# EAGLE design cft-int-board (EAGLE 5.11)
DRAWN_BY: Alexios; PROJECT_NAME: CFT Mini-Computer; REVISION: Rev J; SHEET_DESCRIPTION: Bus Connectors; SIMULATION_FILENAME: N/A; URL: http://www.bedroomlan.org/cft

## Sheet 1 of 3
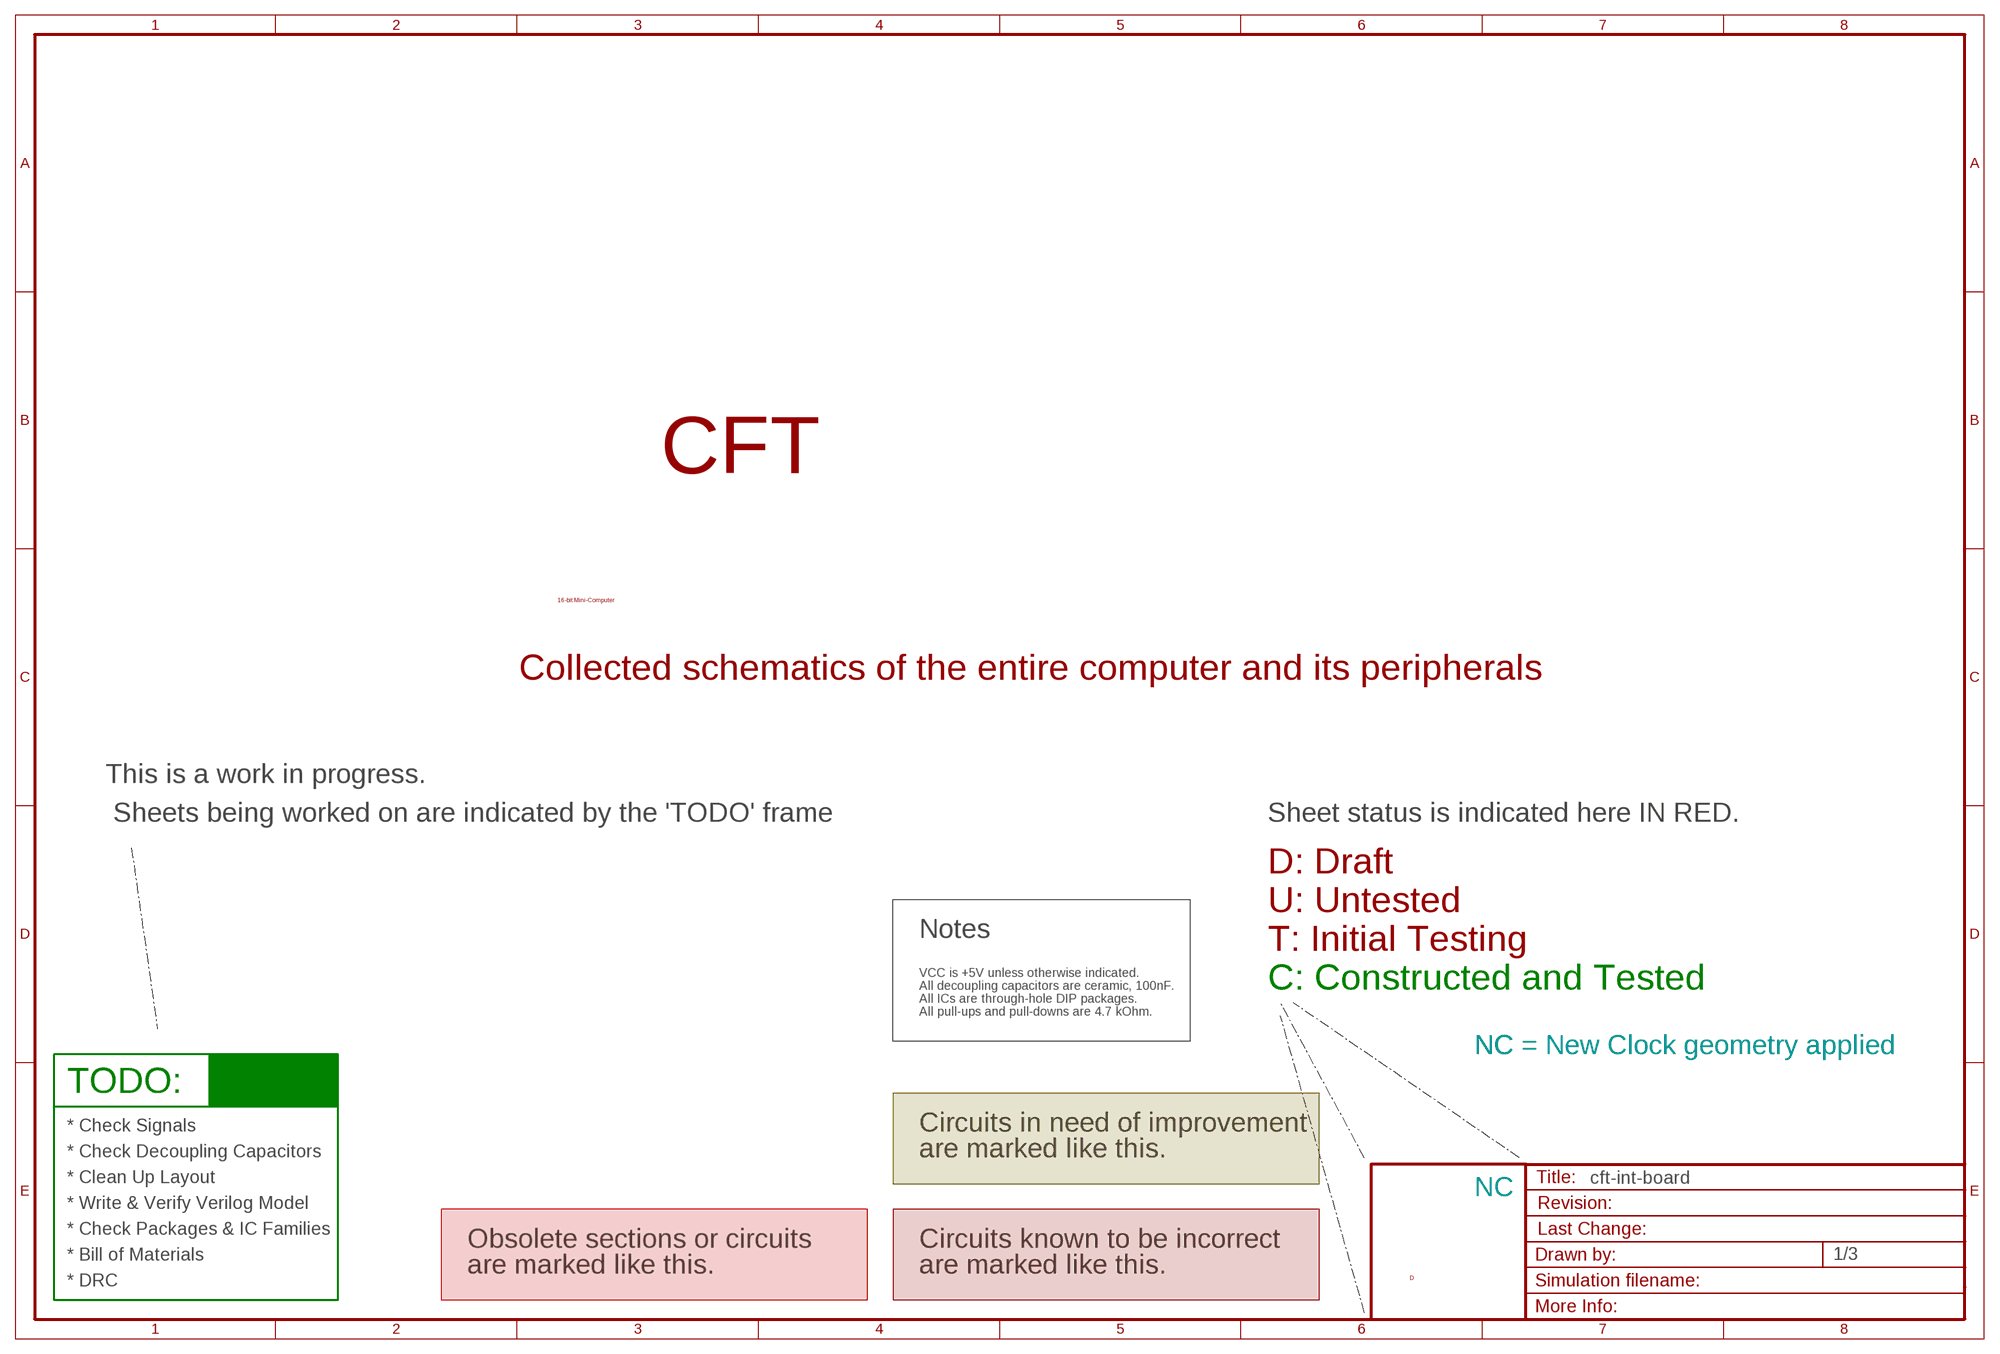
[diagram p0: schematic, sheet 1]

### Notes on the sheet
- CFT
- 16-bit Mini-Computer
- Collected schematics of the entire computer and its peripherals
- This is a work in progress.
- Sheets being worked on are indicated by the 'TODO' frame | Sheet status is indicated here IN RED.
- D: Draft
- U: Untested
- Notes
- T: Initial Testing
- VCC is +5V unless otherwise indicated.
- All decoupling capacitors are ceramic, 100nF. | C: Constructed and Tested
- All ICs are through-hole DIP packages.
- All pull-ups and pull-downs are 4.7 kOhm.
- NC | NC = New Clock geometry applied
- TODO:
- * Check Signals | Circuits in need of improvement
- * Check Decoupling Capacitors | are marked like this.
- * Clean Up Layout
- NC
- * Write & Verify Verilog Model
- * Check Packages & IC Families
- Obsolete sections or circuits | Circuits known to be incorrect
- * Bill of Materials
- are marked like this. | are marked like this.
- D
- * DRC

## Sheet 2 of 3
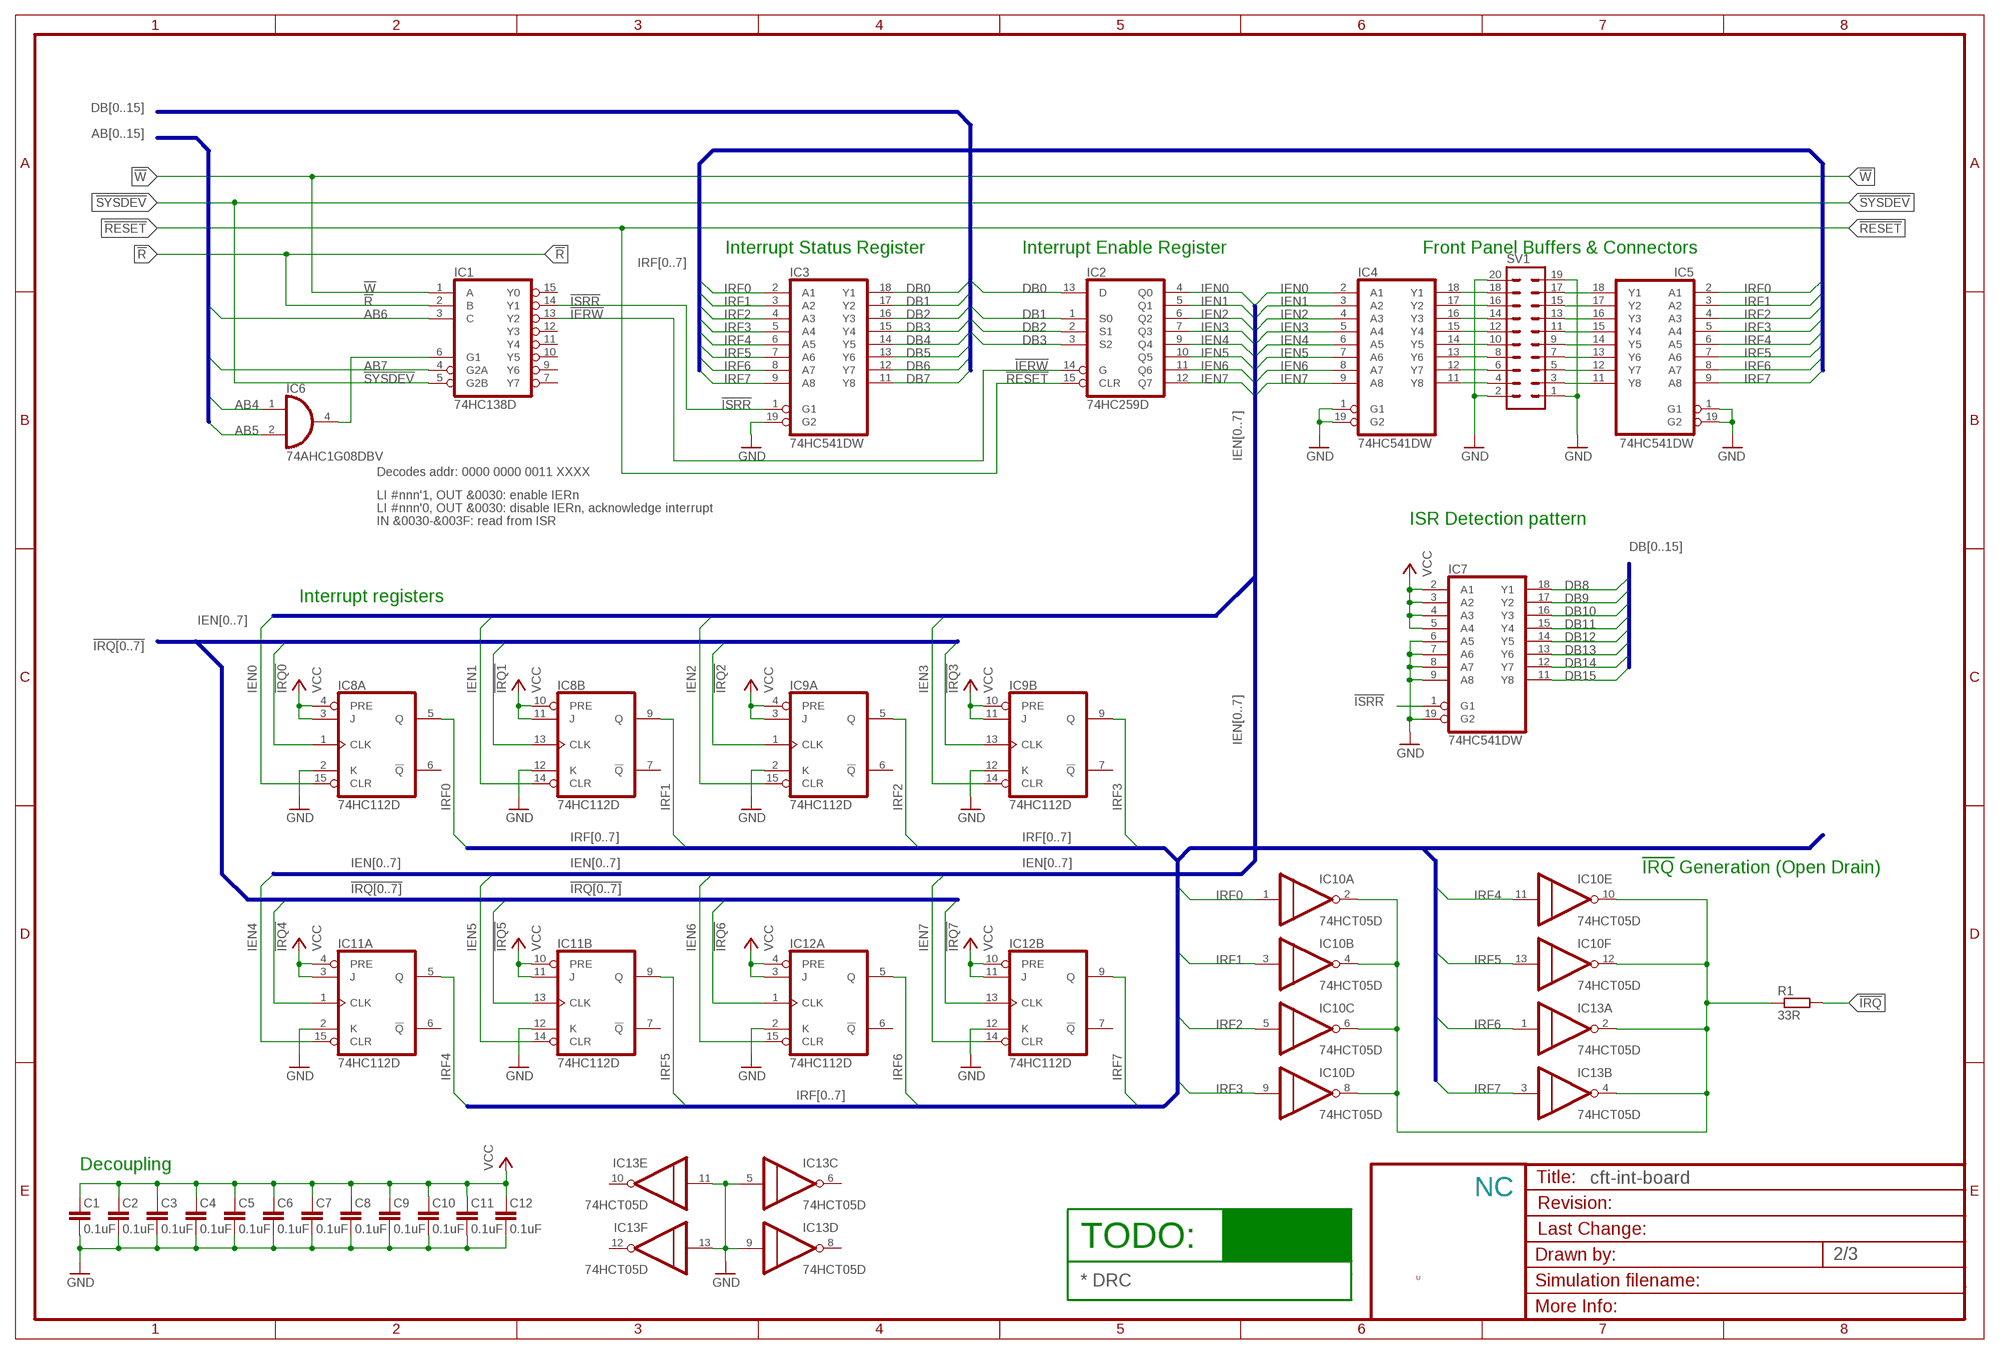
[diagram p1: schematic, sheet 2]

### Parts
C1  0.1uF  C-EUC0805K  [C0805K]
C2  0.1uF  C-EUC0805K  [C0805K]
C3  0.1uF  C-EUC0805K  [C0805K]
C4  0.1uF  C-EUC0805K  [C0805K]
C5  0.1uF  C-EUC0805K  [C0805K]
C6  0.1uF  C-EUC0805K  [C0805K]
C7  0.1uF  C-EUC0805K  [C0805K]
C8  0.1uF  C-EUC0805K  [C0805K]
C9  0.1uF  C-EUC0805K  [C0805K]
C10  0.1uF  C-EUC0805K  [C0805K]
C11  0.1uF  C-EUC0805K  [C0805K]
C12  0.1uF  C-EUC0805K  [C0805K]
IC1  74HC138D  [SO16]
IC2  74HC259D  [SO16]
IC3  74HC541DW  [SO20W]
IC4  74HC541DW  [SO20W]
IC5  74HC541DW  [SO20W]
IC6  74AHC1G08DBV  [SOT23-5]
IC7  74HC541DW  [SO20W]
IC8  74HC112D  [SO16]
IC9  74HC112D  [SO16]
IC10  74HCT05D  [SO14]
IC11  74HC112D  [SO16]
IC12  74HC112D  [SO16]
IC13  74HCT05D  [SO14]
R1  33R  R-EU_M0805  [M0805]
SV1  ML20L  [ML20L]

### Nets
!IERW: IC1.13(Y2) IC2.14(G)
!IRQ: R1.2 ; also sheet 3
!IRQ0: IC8.1(A:CLK) ; also sheet 3
!IRQ1: IC8.13(B:CLK) ; also sheet 3
!IRQ2: IC9.1(A:CLK) ; also sheet 3
!IRQ3: IC9.13(B:CLK) ; also sheet 3
!IRQ4: IC11.1(A:CLK) ; also sheet 3
!IRQ5: IC11.13(B:CLK) ; also sheet 3
!IRQ6: IC12.1(A:CLK) ; also sheet 3
!IRQ7: IC12.13(B:CLK) ; also sheet 3
!IRQ-OUT: IC10.2(A:O) IC10.4(B:O) IC10.6(C:O) IC10.8(D:O) IC10.10(E:O) IC10.12(F:O) IC13.2(A:O) IC13.4(B:O) R1.1
!ISRR: IC1.14(Y1) IC3.1(G1) IC7.1(G1)
!R: IC1.2(B) ; also sheet 3
!RESET: IC2.15(CLR) ; also sheet 3
!SYSDEV: IC1.5(G2B) ; also sheet 3
!W: IC1.1(A) ; also sheet 3
AB4: IC6.1(I0) ; also sheet 3
AB5: IC6.2(I1) ; also sheet 3
AB6: IC1.3(C) ; also sheet 3
AB7: IC1.4(G2A) ; also sheet 3
DB0: IC2.13(D) IC3.18(Y1) ; also sheet 3
DB1: IC2.1(S0) IC3.17(Y2) ; also sheet 3
DB2: IC2.2(S1) IC3.16(Y3) ; also sheet 3
DB3: IC2.3(S2) IC3.15(Y4) ; also sheet 3
DB4: IC3.14(Y5) ; also sheet 3
DB5: IC3.13(Y6) ; also sheet 3
DB6: IC3.12(Y7) ; also sheet 3
DB7: IC3.11(Y8) ; also sheet 3
DB8: IC7.18(Y1) ; also sheet 3
DB9: IC7.17(Y2) ; also sheet 3
DB10: IC7.16(Y3) ; also sheet 3
DB11: IC7.15(Y4) ; also sheet 3
DB12: IC7.14(Y5) ; also sheet 3
DB13: IC7.13(Y6) ; also sheet 3
DB14: IC7.12(Y7) ; also sheet 3
DB15: IC7.11(Y8) ; also sheet 3
GND [low power]: C1.1 C2.1 IC3.19(G2) IC4.1(G1) IC4.19(G2) IC5.1(G1) IC5.19(G2) IC7.6(A5) IC7.7(A6) IC7.8(A7) IC7.9(A8) IC7.19(G2) IC8.2(A:K) IC8.12(B:K) IC9.2(A:K) IC9.12(B:K) IC11.2(A:K) IC11.12(B:K) IC12.2(A:K) IC12.12(B:K) IC13.5(C:I) IC13.9(D:I) IC13.11(E:I) IC13.13(F:I) SV1.1 SV1.2 SV1.19 SV1.20 ; also sheet 3
IEN0: IC2.4(Q0) IC4.2(A1) IC8.15(A:CLR)
IEN1: IC2.5(Q1) IC4.3(A2) IC8.14(B:CLR)
IEN2: IC2.6(Q2) IC4.4(A3) IC9.15(A:CLR)
IEN3: IC2.7(Q3) IC4.5(A4) IC9.14(B:CLR)
IEN4: IC2.9(Q4) IC4.6(A5) IC11.15(A:CLR)
IEN5: IC2.10(Q5) IC4.7(A6) IC11.14(B:CLR)
IEN6: IC2.11(Q6) IC4.8(A7) IC12.15(A:CLR)
IEN7: IC2.12(Q7) IC4.9(A8) IC12.14(B:CLR)
IRF0: IC3.2(A1) IC5.2(A1) IC8.5(A:Q) IC10.1(A:I)
IRF1: IC3.3(A2) IC5.3(A2) IC8.9(B:Q) IC10.3(B:I)
IRF2: IC3.4(A3) IC5.4(A3) IC9.5(A:Q) IC10.5(C:I)
IRF3: IC3.5(A4) IC5.5(A4) IC9.9(B:Q) IC10.9(D:I)
IRF4: IC3.6(A5) IC5.6(A5) IC10.11(E:I) IC11.5(A:Q)
IRF5: IC3.7(A6) IC5.7(A6) IC10.13(F:I) IC11.9(B:Q)
IRF6: IC3.8(A7) IC5.8(A7) IC12.5(A:Q) IC13.1(A:I)
IRF7: IC3.9(A8) IC5.9(A8) IC12.9(B:Q) IC13.3(B:I)
N$1: IC4.18(Y1) SV1.18
N$2: IC4.17(Y2) SV1.16
N$3: IC4.16(Y3) SV1.14
N$4: IC4.15(Y4) SV1.12
N$5: IC4.14(Y5) SV1.10
N$6: IC4.13(Y6) SV1.8
N$7: IC4.12(Y7) SV1.6
N$8: IC4.11(Y8) SV1.4
N$9: IC5.18(Y1) SV1.17
N$10: IC5.17(Y2) SV1.15
N$11: IC5.16(Y3) SV1.13
N$12: IC5.15(Y4) SV1.11
N$13: IC5.14(Y5) SV1.9
N$14: IC5.13(Y6) SV1.7
N$15: IC5.12(Y7) SV1.5
N$16: IC5.11(Y8) SV1.3
N$381: IC1.6(G1) IC6.4(O)
VCC [low power]: C1.2 C2.2 IC7.2(A1) IC7.3(A2) IC7.4(A3) IC7.5(A4) IC8.3(A:J) IC8.4(A:PRE) IC8.10(B:PRE) IC8.11(B:J) IC9.3(A:J) IC9.4(A:PRE) IC9.10(B:PRE) IC9.11(B:J) IC11.3(A:J) IC11.4(A:PRE) IC11.10(B:PRE) IC11.11(B:J) IC12.3(A:J) IC12.4(A:PRE) IC12.10(B:PRE) IC12.11(B:J) ; also sheet 3
Unconnected: C3.1 C3.2 C4.1 C4.2 C5.1 C5.2 C6.1 C6.2 C7.1 C7.2 C8.1 C8.2 C9.1 C9.2 C10.1 C10.2 C11.1 C11.2 C12.1 C12.2 IC1.7(Y7) IC1.9(Y6) IC1.10(Y5) IC1.11(Y4) IC1.12(Y3) IC1.15(Y0) IC8.6(A:!Q) IC8.7(B:!Q) IC9.6(A:!Q) IC9.7(B:!Q) IC11.6(A:!Q) IC11.7(B:!Q) IC12.6(A:!Q) IC12.7(B:!Q) IC13.6(C:O) IC13.8(D:O) IC13.10(E:O) IC13.12(F:O)

### Buses
AB[0..15]
DB[0..15]
!IRQ[0..7]
IEN[0..7]
IRF[0..7]

### Notes on the sheet
- Interrupt Status Register | Interrupt Enable Register | Front Panel Buffers & Connectors
- Decodes addr: 0000 0000 0011 XXXX
- LI #nnn'1, OUT &0030: enable IERn
- LI #nnn'0, OUT &0030: disable IERn, acknowledge interrupt
- IN &0030-&003F: read from ISR | ISR Detection pattern
- Interrupt registers
- !IRQ! Generation (Open Drain)
- Decoupling
- NC
- TODO:
- U
- * DRC

## Sheet 3 of 3
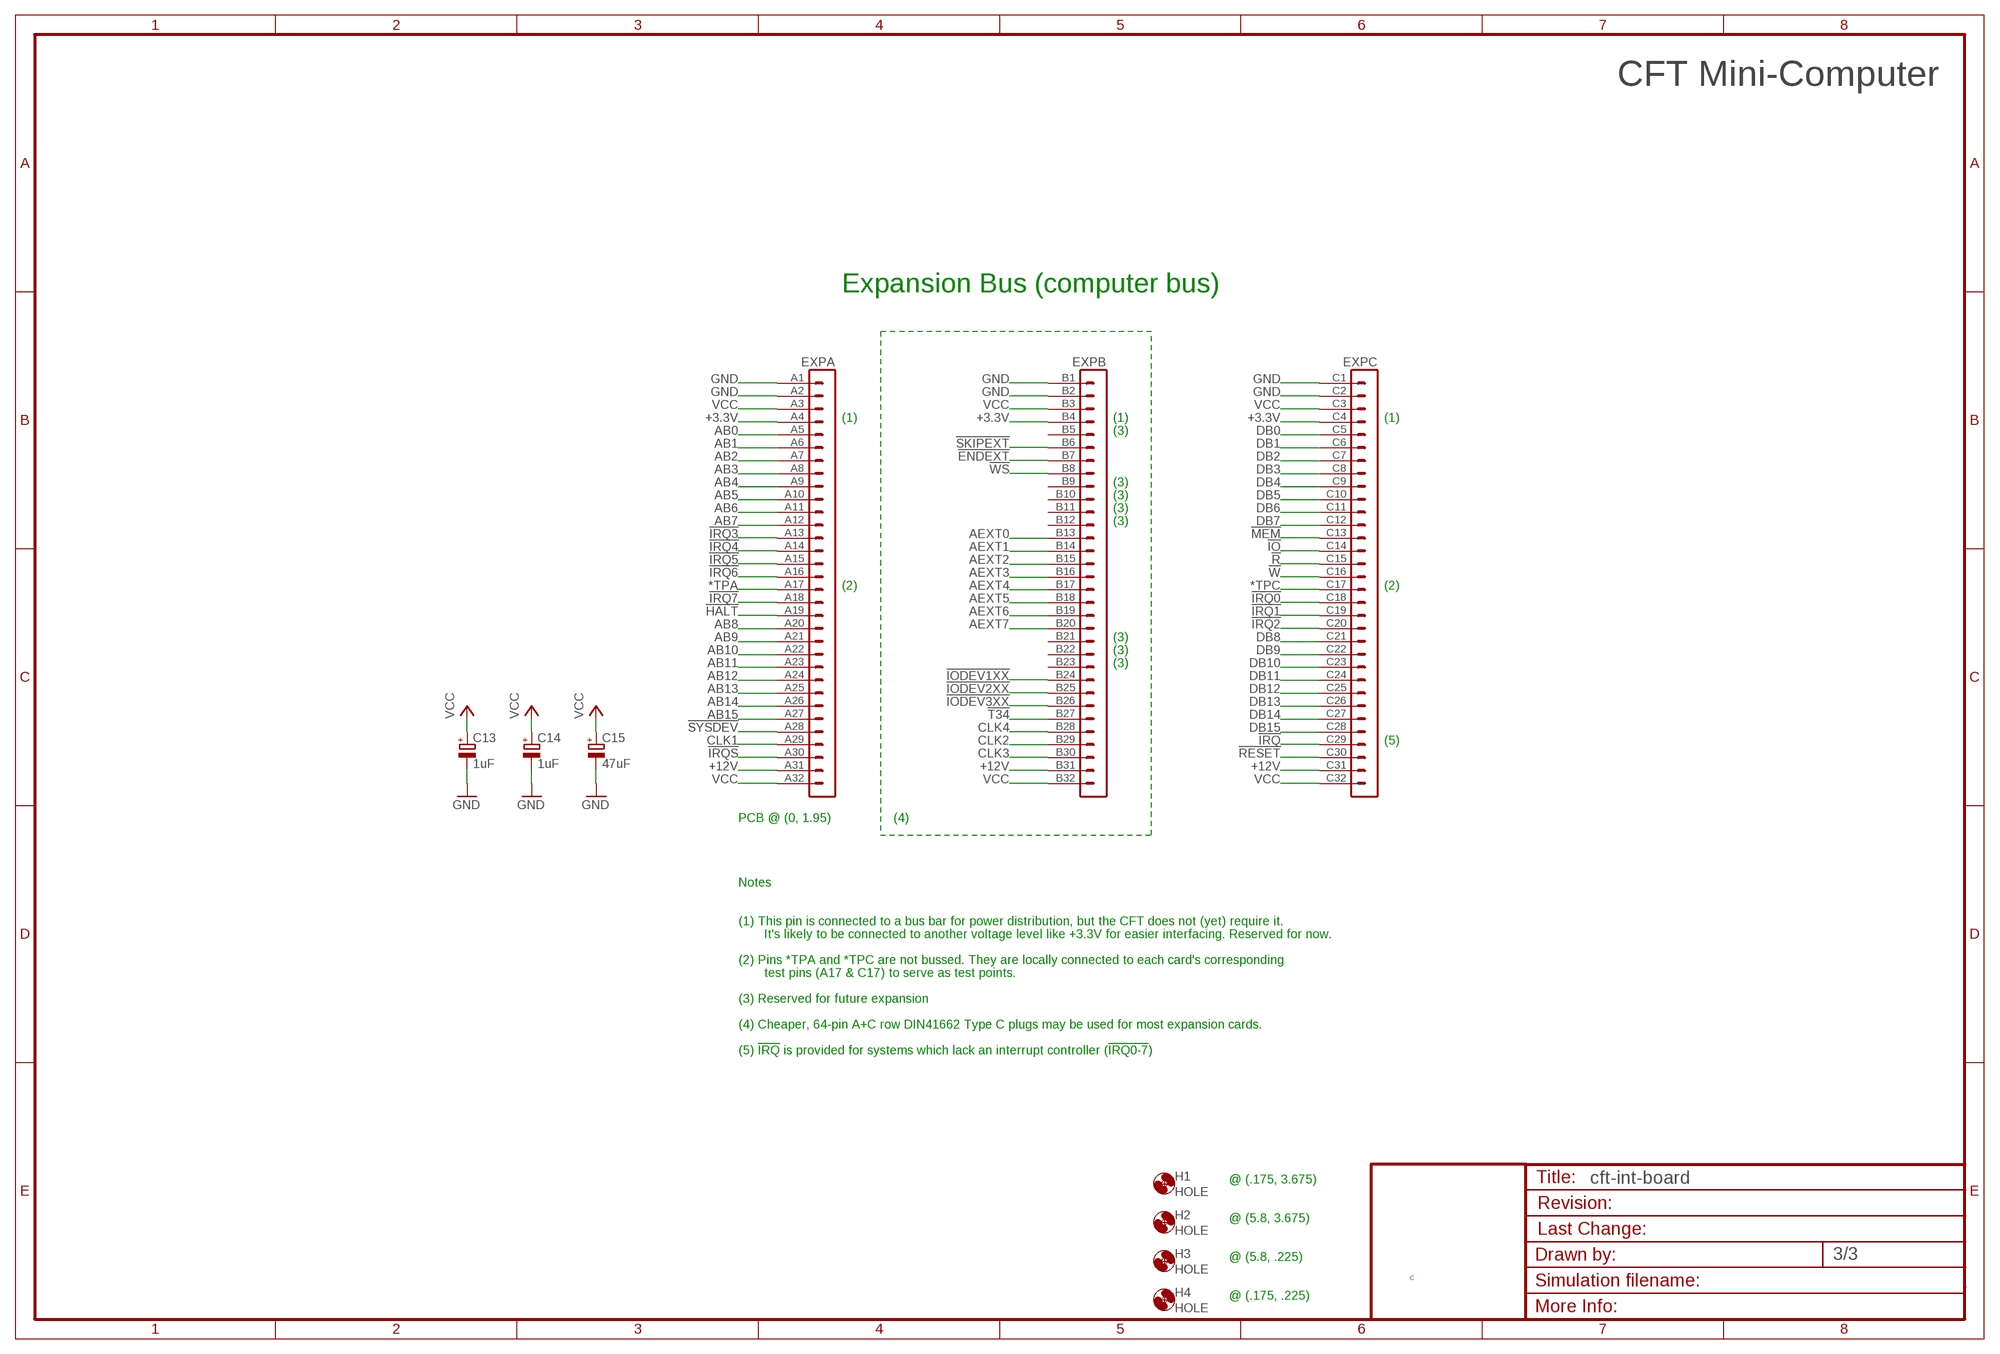
[diagram p2: schematic, sheet 3]

### Parts
C13  1uF  CPOL-EUE2.5-5  [E2,5-5]
C14  1uF  CPOL-EUE2.5-5  [E2,5-5]
C15  47uF  CPOL-EUE2.5-5  [E2,5-5]
EXP  VG96-3K  [VG96K]
H1  HOLE  [STANDOFF_28_60]
H2  HOLE  [STANDOFF_28_60]
H3  HOLE  [STANDOFF_28_60]
H4  HOLE  [STANDOFF_28_60]

### Nets
!ENDEXT: EXP.B7
!HALT: EXP.A19
!IO: EXP.C14
!IODEV1XX: EXP.B24
!IODEV2XX: EXP.B25
!IODEV3XX: EXP.B26
!IRQ: EXP.C29 ; also sheet 2
!IRQ0: EXP.C18 ; also sheet 2
!IRQ1: EXP.C19 ; also sheet 2
!IRQ2: EXP.C20 ; also sheet 2
!IRQ3: EXP.A13 ; also sheet 2
!IRQ4: EXP.A14 ; also sheet 2
!IRQ5: EXP.A15 ; also sheet 2
!IRQ6: EXP.A16 ; also sheet 2
!IRQ7: EXP.A18 ; also sheet 2
!IRQS: EXP.A30
!MEM: EXP.C13
!R: EXP.C15 ; also sheet 2
!RESET: EXP.C30 ; also sheet 2
!SKIPEXT: EXP.B6
!SYSDEV: EXP.A28 ; also sheet 2
!T34: EXP.B27
!W: EXP.C16 ; also sheet 2
!WS: EXP.B8
*TPA: EXP.A17
*TPC: EXP.C17
+3.3V: EXP.A4 EXP.B4 EXP.C4
+12V [LED power]: EXP.A31 EXP.B31 EXP.C31
AB0: EXP.A5
AB1: EXP.A6
AB2: EXP.A7
AB3: EXP.A8
AB4: EXP.A9 ; also sheet 2
AB5: EXP.A10 ; also sheet 2
AB6: EXP.A11 ; also sheet 2
AB7: EXP.A12 ; also sheet 2
AB8: EXP.A20
AB9: EXP.A21
AB10: EXP.A22
AB11: EXP.A23
AB12: EXP.A24
AB13: EXP.A25
AB14: EXP.A26
AB15: EXP.A27
AEXT0: EXP.B13
AEXT1: EXP.B14
AEXT2: EXP.B15
AEXT3: EXP.B16
AEXT4: EXP.B17
AEXT5: EXP.B18
AEXT6: EXP.B19
AEXT7: EXP.B20
CLK1: EXP.A29
CLK2: EXP.B29
CLK3: EXP.B30
CLK4: EXP.B28
DB0: EXP.C5 ; also sheet 2
DB1: EXP.C6 ; also sheet 2
DB2: EXP.C7 ; also sheet 2
DB3: EXP.C8 ; also sheet 2
DB4: EXP.C9 ; also sheet 2
DB5: EXP.C10 ; also sheet 2
DB6: EXP.C11 ; also sheet 2
DB7: EXP.C12 ; also sheet 2
DB8: EXP.C21 ; also sheet 2
DB9: EXP.C22 ; also sheet 2
DB10: EXP.C23 ; also sheet 2
DB11: EXP.C24 ; also sheet 2
DB12: EXP.C25 ; also sheet 2
DB13: EXP.C26 ; also sheet 2
DB14: EXP.C27 ; also sheet 2
DB15: EXP.C28 ; also sheet 2
GND [low power]: C13.- C14.- C15.- EXP.A1 EXP.A2 EXP.B1 EXP.B2 EXP.C1 EXP.C2 ; also sheet 2
VCC [low power]: C13.+ C14.+ C15.+ EXP.A3 EXP.A32 EXP.B3 EXP.B32 EXP.C3 EXP.C32 ; also sheet 2
Unconnected: EXP.B5 EXP.B9 EXP.B10 EXP.B11 EXP.B12 EXP.B21 EXP.B22 EXP.B23

### Notes on the sheet
- CFT Mini-Computer
- Expansion Bus (computer bus)
- (1) | (1) | (1)
- (3)
- (3)
- (3)
- (3)
- (3)
- (2) | (2)
- (3)
- (3)
- (3)
- (5)
- PCB @ (0, 1.95) | (4)
- Notes
- (1) This pin is connected to a bus bar for power distribution, but the CFT does not (yet) require it.
- It's likely to be connected to another voltage level like +3.3V for easier interfacing. Reserved for now.
- (2) Pins *TPA and *TPC are not bussed. They are locally connected to each card's corresponding
- test pins (A17 & C17) to serve as test points.
- (3) Reserved for future expansion
- (4) Cheaper, 64-pin A+C row DIN41662 Type C plugs may be used for most expansion cards.
- (5) !IRQ! is provided for systems which lack an interrupt controller (!IRQ0-7!)
- @ (.175, 3.675)
- @ (5.8, 3.675)
- @ (5.8, .225)
- C
- @ (.175, .225)

## Power pins joined to a net without a drawn wire
GND: IC1.8(GND) IC2.8(GND) IC3.10(GND) IC4.10(GND) IC5.10(GND) IC6.3(GND) IC7.10(GND) IC8.8(P:GND) IC9.8(P:GND) IC10.7(P:GND) IC11.8(P:GND) IC12.8(P:GND) IC13.7(P:GND)
VCC: IC1.16(VCC) IC2.16(VCC) IC3.20(VCC) IC4.20(VCC) IC5.20(VCC) IC6.5(VCC) IC7.20(VCC) IC8.16(P:VCC) IC9.16(P:VCC) IC10.14(P:VCC) IC11.16(P:VCC) IC12.16(P:VCC) IC13.14(P:VCC)

## Library data of the parts
C1-C12 = rcl:C-EU: CAPACITOR, European symbol
C13-C15 = rcl:CPOL-EU: POLARIZED CAPACITOR, European symbol
EXP = alexios-19inch:VG96-3: PCB EUROCARD, 96-pin type C/ABC, 2.54 mm
H1-H4 = alexios:HOLE: Hole for a standoff or mount. Hole diameter: 3.3mm. External Diameter: 6mm.
IC1 = alexios:74*138: 3-line to 8-line DECODER/DEMULTIPLEXER
IC2 = alexios:74*259: 8-bit addressable LATCH
IC3-IC5 IC7 = alexios:74*541: Octal BUFFER and LINE DRIVER, 3-state
IC6 = alexios:74*1G08: 2-input AND gate
IC8 IC9 IC11 IC12 = alexios:74*112: Dual J-K negative edge triggered FLIP FLOP, preset and clear
IC10 IC13 = alexios:74*05: Hex INVERTER, open collector/drain
R1 = resistor:R-EU_: RESISTOR, European symbol
SV1 = con-harting-ml:ML20: HARTING; OC_FARNELL: unknown; OC_NEWARK: unknown

## Net classes
0 default: width 0.305 mm, clearance 0.203 mm
1 low power: width 1.27 mm, clearance 0.254 mm
2 LED power: width 1.93 mm, clearance 0.254 mm

## Board
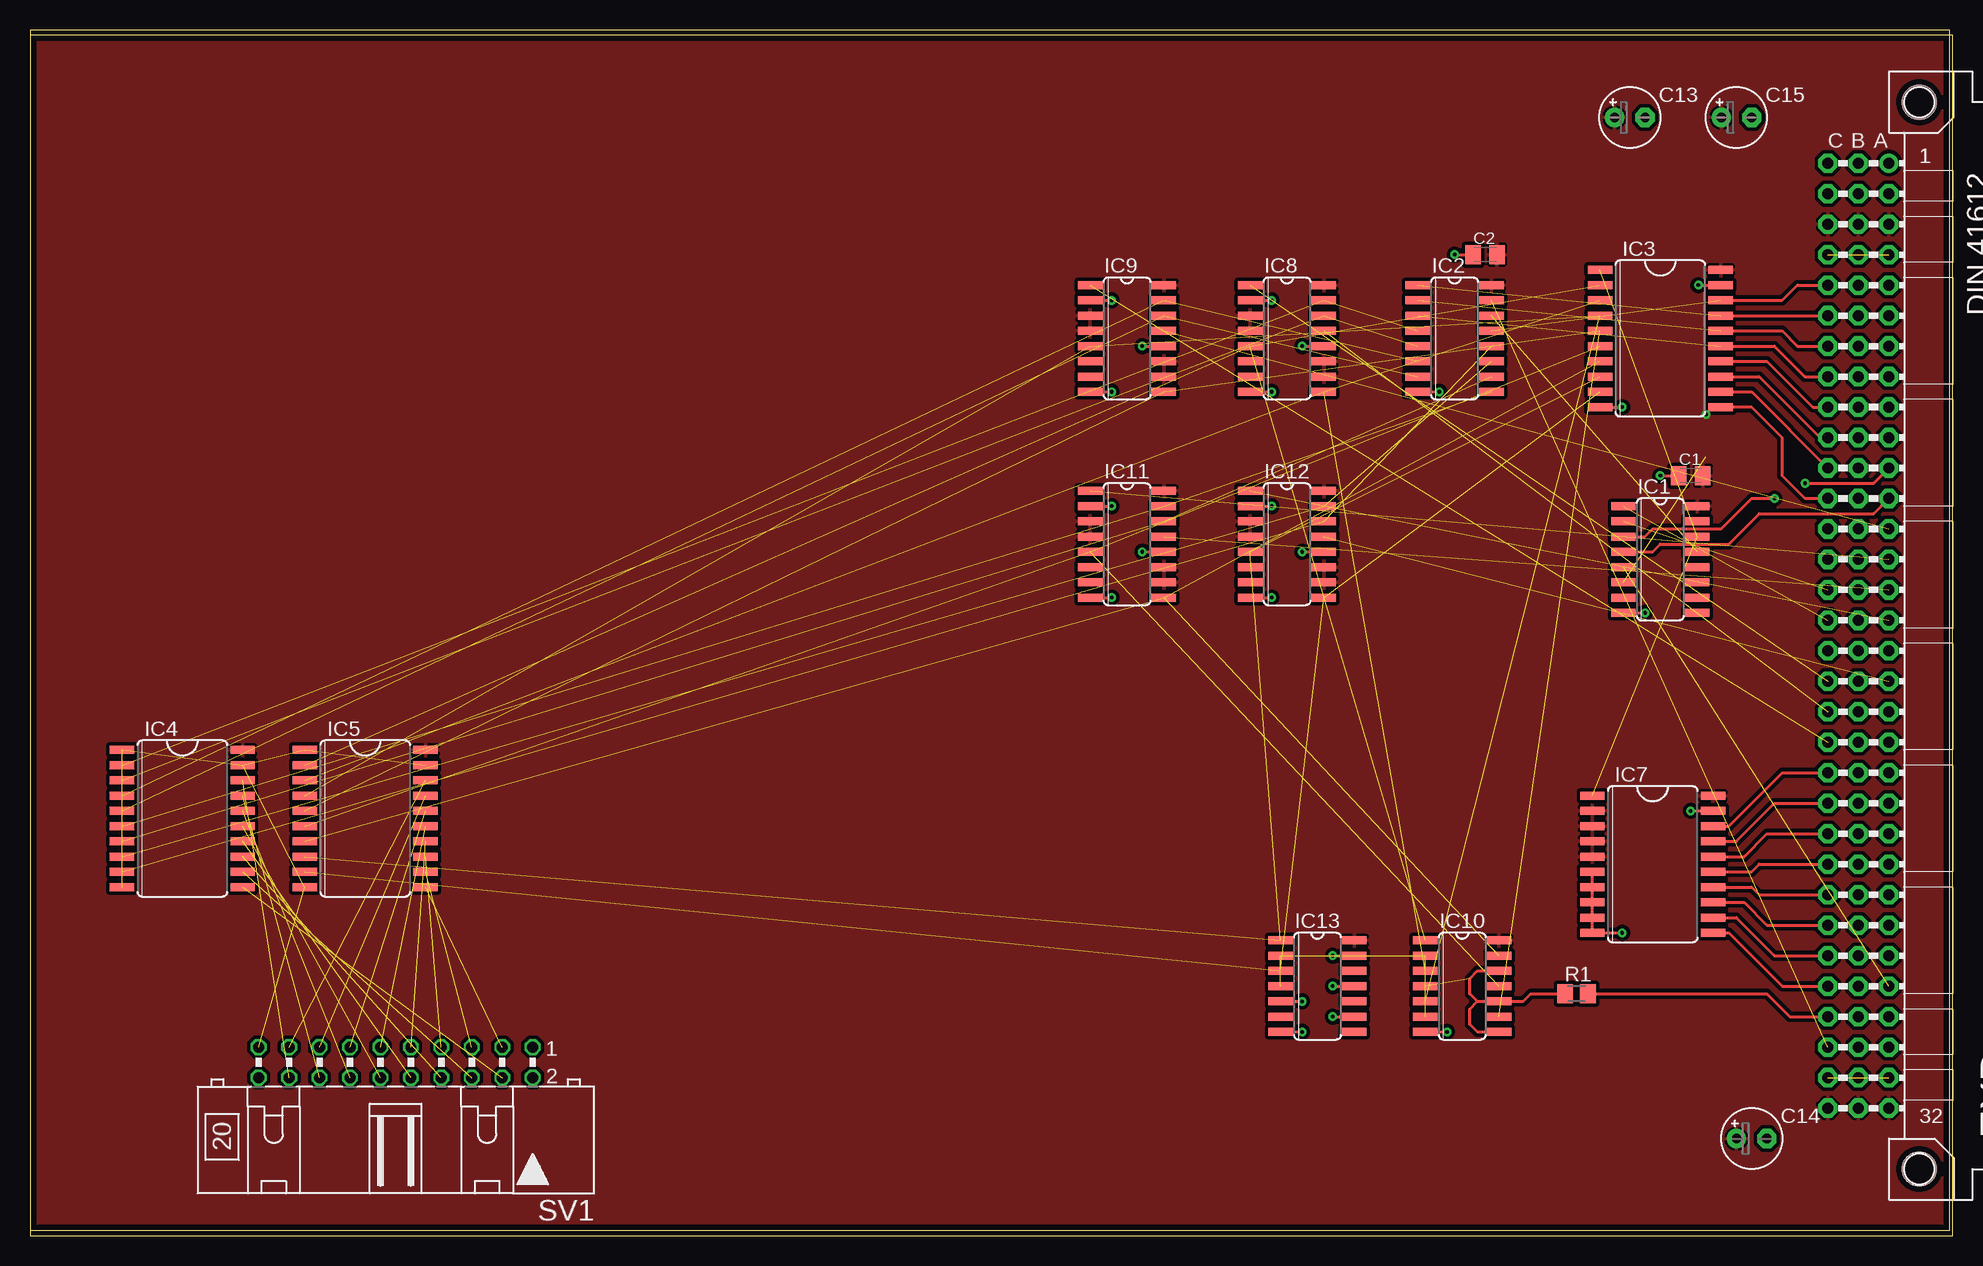
[diagram p3: board, top side]
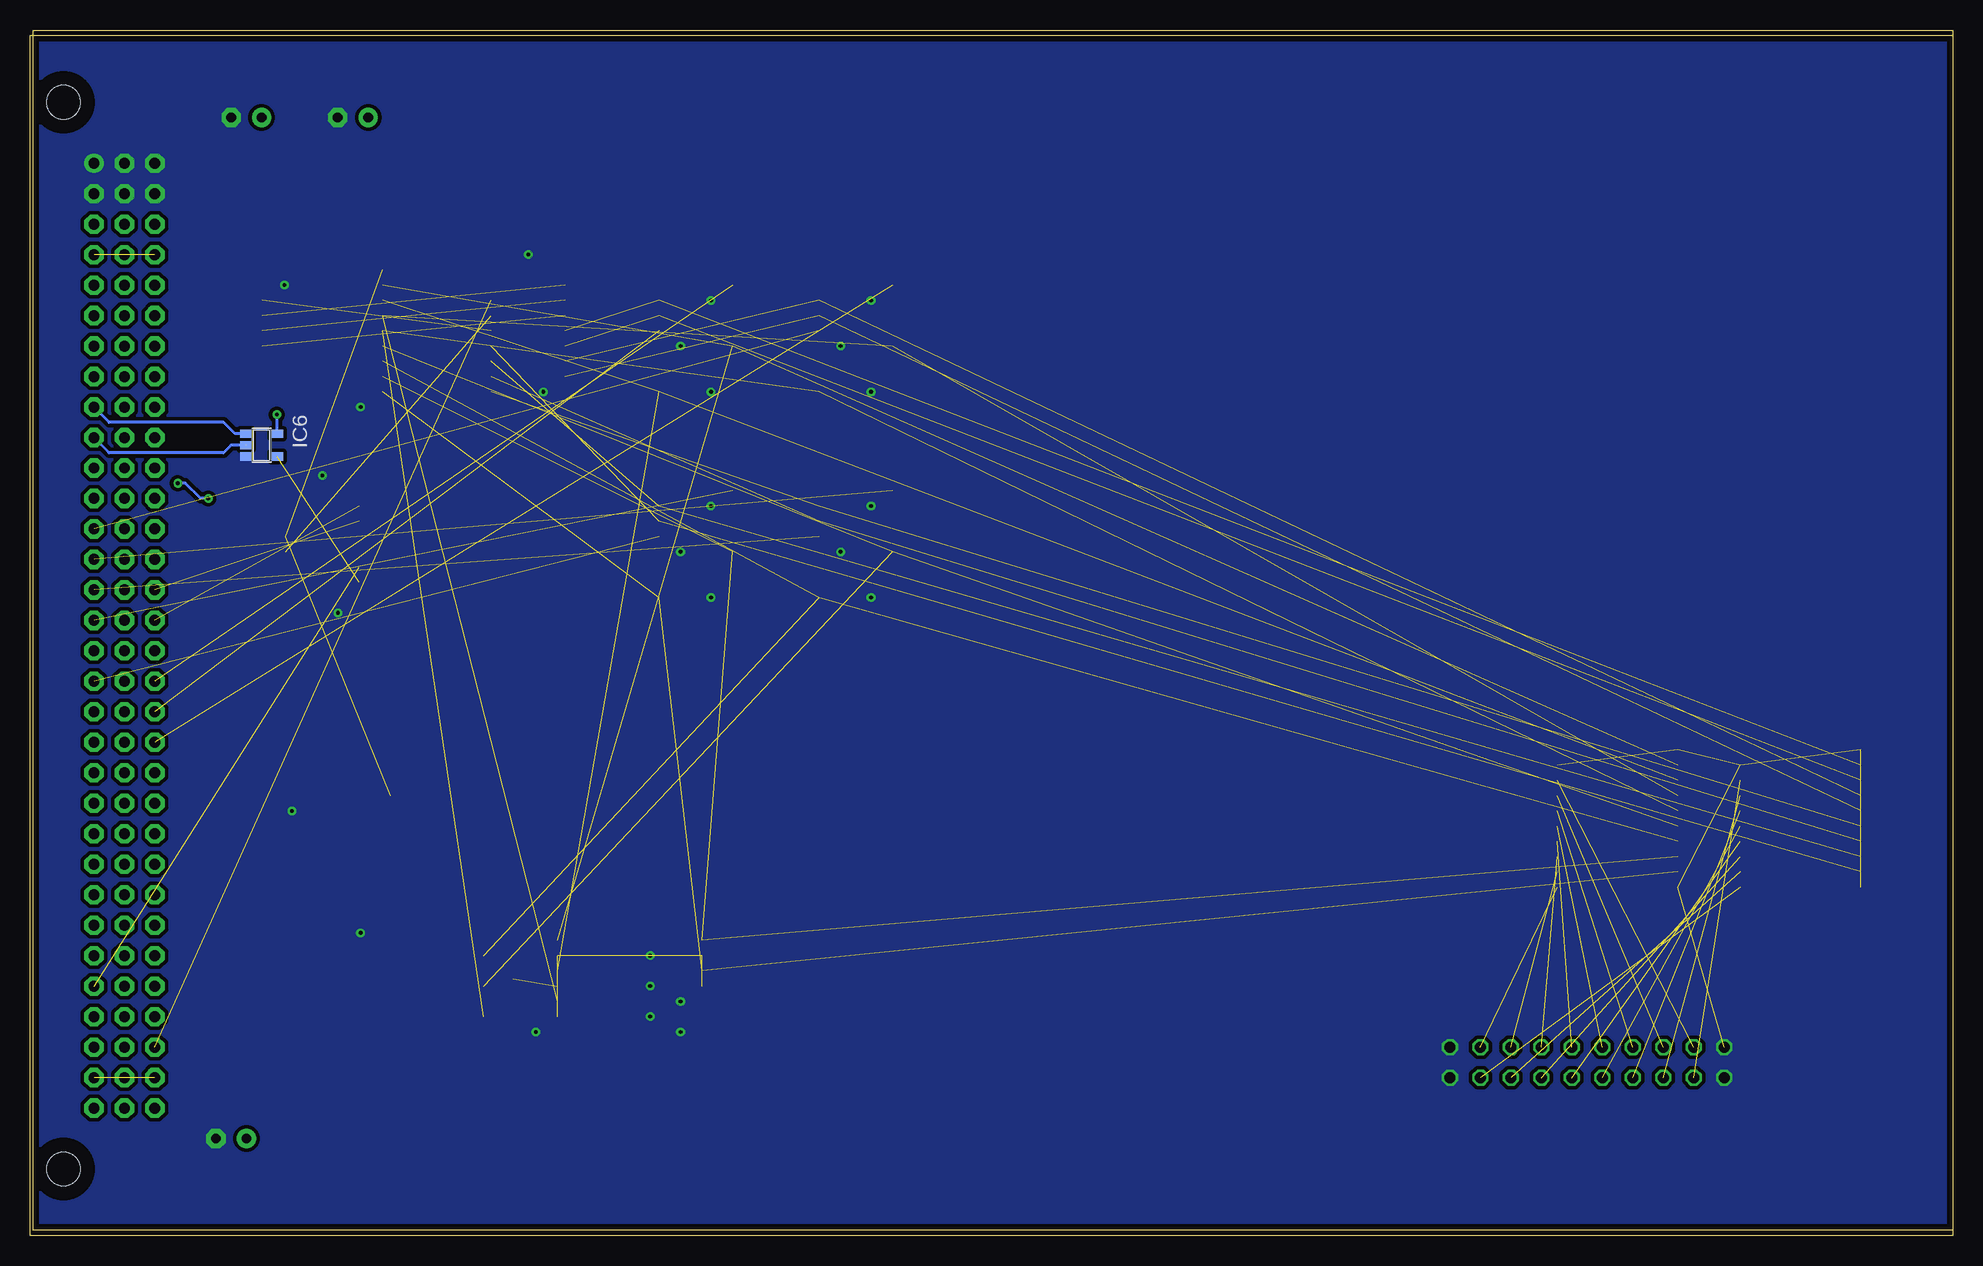
[diagram p4: board, bottom side, seen from below]

Size 160 x 100 mm. Coordinates in mm from the lower left corner, seen from the top.
Outline: 0,0 160,0 160,100 0,100 0,0
Copper layers (1*16): Top 0.035mm / dielectric 0.2mm / Bottom 0.035mm
Design rules "MyroPCB-8mil-prototyping": minimum track width 8mil, minimum drill 12mil, track to track 8mil, track to pad 8mil, pad to pad 8mil, via to via 8mil, smd to smd 8mil, copper to edge 20mil, drill to drill 8mil, minimum pad ring 8mil, minimum via ring 8mil, stop-mask expansion 4mil, vias tented up to drill 0mil, thermal gap 8mil

### Footprints (pad centres in the part's own frame; a part is rotated, then mirrored left to right if it is on the bottom)
C0805K = smd 1.3 x 1.6: 1 -1,0; 2 1,0
E2,5-5 = drill 0.813 pad 1.6 round: + -1.27,0 | drill 0.813 pad 1.6 octagon: - 1.27,0
VG96K = drill 0.914 pad 1.6 round: A1 154.94,39.37 | drill 0.914 pad 1.6 octagon: A2 154.94,36.83; A3 154.94,34.29; A4 154.94,31.75; A5 154.94,29.21; A6 154.94,26.67; A7 154.94,24.13; A8 154.94,21.59; A9 154.94,19.05; A10 154.94,16.51; A11 154.94,13.97; A12 154.94,11.43; A13 154.94,8.89; A14 154.94,6.35; A15 154.94,3.81; A16 154.94,1.27; A17 154.94,-1.27; A18 154.94,-3.81; A19 154.94,-6.35; A20 154.94,-8.89; A21 154.94,-11.43; A22 154.94,-13.97; A23 154.94,-16.51; A24 154.94,-19.05; A25 154.94,-21.59; A26 154.94,-24.13; A27 154.94,-26.67; A28 154.94,-29.21; A29 154.94,-31.75; A30 154.94,-34.29; A31 154.94,-36.83; A32 154.94,-39.37; B1 152.4,39.37; B2 152.4,36.83; B3 152.4,34.29; B4 152.4,31.75; B5 152.4,29.21; B6 152.4,26.67; B7 152.4,24.13; B8 152.4,21.59; B9 152.4,19.05; B10 152.4,16.51; B11 152.4,13.97; B12 152.4,11.43; B13 152.4,8.89; B14 152.4,6.35; B15 152.4,3.81; B16 152.4,1.27; B17 152.4,-1.27; B18 152.4,-3.81; B19 152.4,-6.35; B20 152.4,-8.89; B21 152.4,-11.43; B22 152.4,-13.97; B23 152.4,-16.51; B24 152.4,-19.05; B25 152.4,-21.59; B26 152.4,-24.13; B27 152.4,-26.67; B28 152.4,-29.21; B29 152.4,-31.75; B30 152.4,-34.29; B31 152.4,-36.83; B32 152.4,-39.37; C1 149.86,39.37; C2 149.86,36.83; C3 149.86,34.29; C4 149.86,31.75; C5 149.86,29.21; C6 149.86,26.67; C7 149.86,24.13; C8 149.86,21.59; C9 149.86,19.05; C10 149.86,16.51; C11 149.86,13.97; C12 149.86,11.43; C13 149.86,8.89; C14 149.86,6.35; C15 149.86,3.81; C16 149.86,1.27; C17 149.86,-1.27; C18 149.86,-3.81; C19 149.86,-6.35; C20 149.86,-8.89; C21 149.86,-11.43; C22 149.86,-13.97; C23 149.86,-16.51; C24 149.86,-19.05; C25 149.86,-21.59; C26 149.86,-24.13; C27 149.86,-26.67; C28 149.86,-29.21; C29 149.86,-31.75; C30 149.86,-34.29; C31 149.86,-36.83; C32 149.86,-39.37 | hole 2.794: 157.48,44.45; 157.48,-44.45
STANDOFF_28_60 = hole 3.302: 0,0
SO16 = smd 0.66 x 2.032: 1 -4.445,-3.073; 2 -3.175,-3.073; 3 -1.905,-3.073; 4 -0.635,-3.073; 5 0.635,-3.073; 6 1.905,-3.073; 7 3.175,-3.073; 8 4.445,-3.073; 9 4.445,3.073; 10 3.175,3.073; 11 1.905,3.073; 12 0.635,3.073; 13 -0.635,3.073; 14 -1.905,3.073; 15 -3.175,3.073; 16 -4.445,3.073
SO20W = smd 0.66 x 2.032: 1 -5.715,-5.029; 2 -4.445,-5.029; 3 -3.175,-5.029; 4 -1.905,-5.029; 5 -0.635,-5.029; 6 0.635,-5.029; 7 1.905,-5.029; 8 3.175,-5.029; 9 4.445,-5.029; 10 5.715,-5.029; 11 5.715,5.029; 12 4.445,5.029; 13 3.175,5.029; 14 1.905,5.029; 15 0.635,5.029; 16 -0.635,5.029; 17 -1.905,5.029; 18 -3.175,5.029; 19 -4.445,5.029; 20 -5.715,5.029
SOT23-5 = smd 0.69 x 0.99: 1 -0.95,-1.29; 2 0,-1.29; 3 0.95,-1.29; 4 0.95,1.3; 5 -0.95,1.3
SO14 = smd 0.66 x 2.032: 1 -3.81,-3.073; 2 -2.54,-3.073; 3 -1.27,-3.073; 4 0,-3.073; 5 1.27,-3.073; 6 2.54,-3.073; 7 3.81,-3.073; 8 3.81,3.073; 9 2.54,3.073; 10 1.27,3.073; 11 0,3.073; 12 -1.27,3.073; 13 -2.54,3.073; 14 -3.81,3.073
M0805 = smd 1.3 x 1.6: 1 -0.95,0; 2 0.95,0
ML20L = drill 0.914 octagon: 1 -11.43,-1.27; 2 -11.43,1.27; 3 -8.89,-1.27; 4 -8.89,1.27; 5 -6.35,-1.27; 6 -6.35,1.27; 7 -3.81,-1.27; 8 -3.81,1.27; 9 -1.27,-1.27; 10 -1.27,1.27; 11 1.27,-1.27; 12 1.27,1.27; 13 3.81,-1.27; 14 3.81,1.27; 15 6.35,-1.27; 16 6.35,1.27; 17 8.89,-1.27; 18 8.89,1.27; 19 11.43,-1.27; 20 11.43,1.27

### Placement (x,y rotation side)
C1  138.43,62.87 0 top
C2  121.28,81.28 0 top
C3  -90.17,-60.96 0 top  (outside the outline)
C4  -90.17,-66.04 0 top  (outside the outline)
C5  -90.17,-71.12 0 top  (outside the outline)
C6  -90.17,-76.2 0 top  (outside the outline)
C7  -90.17,-81.28 0 top  (outside the outline)
C8  -90.17,-86.36 0 top  (outside the outline)
C9  -90.17,-91.44 0 top  (outside the outline)
C10  -90.17,-96.52 0 top  (outside the outline)
C11  -90.17,-101.6 0 top  (outside the outline)
C12  -90.17,-106.68 0 top  (outside the outline)
C13  133.35,92.71 0 top
C14  143.51,7.62 0 top
C15  142.24,92.71 0 top
EXP  0,49.53 0 top
H1  -60.96,182.88 0 top  (outside the outline)
H2  -67.31,182.88 0 top  (outside the outline)
H3  -73.66,182.88 0 top  (outside the outline)
H4  -80.01,182.88 0 top  (outside the outline)
IC1  135.89,55.88 270 top
IC2  118.75,74.3 270 top
IC3  135.89,74.3 270 top
IC4  12.7,34.29 270 top
IC5  27.94,34.29 270 top
IC6  140.97,65.41 270 bottom
IC7  135.25,30.48 270 top
IC8  104.78,74.3 270 top
IC9  91.44,74.3 270 top
IC10  119.38,20.32 270 top
IC11  91.44,57.15 270 top
IC12  104.78,57.15 270 top
IC13  107.31,20.32 270 top
R1  128.91,19.68 0 top
SV1  30.48,13.97 180 top

### Tracks (layer width: path | path; a pad name or v marks a point on that pad's centre or on a via)
!IERW  (1 unrouted)
!IRQ
  Top 0.254: EXP.C29 146.69,17.78 144.78,19.68 R1.2
!IRQ0  (1 unrouted)
!IRQ1  (1 unrouted)
!IRQ2  (1 unrouted)
!IRQ3  (1 unrouted)
!IRQ4  (1 unrouted)
!IRQ5  (1 unrouted)
!IRQ6  (1 unrouted)
!IRQ7  (1 unrouted)
!IRQ-OUT  (5 unrouted)
  Top 0.254: IC10.12 120.65,21.59 120.02,20.95 120.02,19.68 120.65,19.05 | 120.65,19.05 IC10.10 124.46,19.05 125.09,19.68 R1.1 | IC10.8 120.65,16.51 120.02,17.14 120.02,18.41 120.65,19.05
!ISRR  (2 unrouted)
!R  (1 unrouted)
!RESET  (1 unrouted)
!SYSDEV  (1 unrouted)
!W  (1 unrouted)
+3.3V  (2 unrouted)
+12V  (2 unrouted)
AB4
  Bottom 0.254: IC6.1 143.19,66.36 144.15,67.31 153.67,67.31 EXP.A9
AB5
  Bottom 0.254: IC6.2 143.51,65.41 144.15,64.77 153.67,64.77 EXP.A10
AB6  (via drill 0.3)
  Top 0.254: IC1.3 134.62,57.78 135.25,58.42 140.97,58.42 143.51,60.96 v145.41,60.96 | EXP.A11 153.67,62.23 v147.96,62.23
  Bottom 0.254: v145.41,60.96 146.05,60.96 147.32,62.23 v147.96,62.23
AB7
  Top 0.254: EXP.A12 153.67,59.69 144.15,59.69 141.6,57.15 135.89,57.15 135.25,56.52 IC1.4
DB0  (1 unrouted)
  Top 0.254: EXP.C5 147.32,78.74 146.05,77.47 IC3.18
DB1  (1 unrouted)
  Top 0.254: IC3.17 EXP.C6
DB2  (1 unrouted)
  Top 0.254: EXP.C7 147.32,73.66 146.05,74.93 IC3.16
DB3  (1 unrouted)
  Top 0.254: EXP.C8 147.96,71.12 145.41,73.66 IC3.15
DB4
  Top 0.254: EXP.C9 148.59,68.58 144.78,72.39 IC3.14
DB5
  Top 0.254: EXP.C10 149.22,66.04 144.15,71.12 IC3.13
DB6
  Top 0.254: IC3.12 143.51,69.85 EXP.C11
DB7
  Top 0.254: EXP.C12 147.96,60.96 146.05,62.87 146.05,66.04 143.51,68.58 IC3.11
DB8
  Top 0.254: IC7.18 141.6,33.66 146.05,38.1 EXP.C21
DB9
  Top 0.254: IC7.17 142.24,32.38 145.41,35.56 EXP.C22
DB10
  Top 0.254: IC7.16 142.88,31.11 144.78,33.02 EXP.C23
DB11
  Top 0.254: IC7.15 143.51,29.84 144.15,30.48 EXP.C24
DB12
  Top 0.254: IC7.14 143.51,28.57 144.15,27.94 EXP.C25
DB13
  Top 0.254: IC7.13 142.88,27.3 144.78,25.4 EXP.C26
DB14
  Top 0.254: IC7.12 142.24,26.04 145.41,22.86 EXP.C27
DB15
  Top 0.254: IC7.11 141.6,24.77 146.05,20.32 EXP.C28
GND  (via drill 0.3)  (6 unrouted)
  Top 0.254: IC13.5 v106.05,19.05 | IC13.7 v106.05,16.51 | v108.58,22.86 IC13.13 | v108.58,20.32 IC13.11 | v108.58,17.78 IC13.9 | IC10.7 v118.11,16.51 | v132.72,24.77 IC7.10 IC7.9 IC7.8 IC7.7 IC7.6 | v138.43,34.92 IC7.19 | IC11.8 v90.17,52.7 | IC12.8 v103.5,52.7 | IC1.8 v134.62,51.44 | IC9.8 v90.17,69.85 | IC8.8 v103.5,69.85 | IC2.8 v117.47,69.85 | IC9.2 v90.17,77.47 | v92.71,73.66 IC9.12 | IC8.2 v103.5,77.47 | v106.05,73.66 IC8.12 | v118.75,81.28 C2.1 | v135.89,62.87 C1.1 | IC3.10 v132.72,68.58 | v139.06,78.74 IC3.19 | IC11.2 v90.17,60.33 | v92.71,56.52 IC11.12 | v106.05,56.52 IC12.12 | IC12.2 v103.5,60.33
  pour Bottom (isolate 0.305, rank 6, no thermals): 0,100.33 160.02,100.33 160.02,0 0,0
IEN0  (2 unrouted)
IEN1  (2 unrouted)
IEN2  (2 unrouted)
IEN3  (2 unrouted)
IEN4  (2 unrouted)
IEN5  (2 unrouted)
IEN6  (2 unrouted)
IEN7  (2 unrouted)
IRF0  (3 unrouted)
IRF1  (3 unrouted)
IRF2  (3 unrouted)
IRF3  (3 unrouted)
IRF4  (3 unrouted)
IRF5  (3 unrouted)
IRF6  (3 unrouted)
IRF7  (3 unrouted)
N$1  (1 unrouted)
N$2  (1 unrouted)
N$3  (1 unrouted)
N$4  (1 unrouted)
N$5  (1 unrouted)
N$6  (1 unrouted)
N$7  (1 unrouted)
N$8  (1 unrouted)
N$9  (1 unrouted)
N$10  (1 unrouted)
N$11  (1 unrouted)
N$12  (1 unrouted)
N$13  (1 unrouted)
N$14  (1 unrouted)
N$15  (1 unrouted)
N$16  (1 unrouted)
N$381  (1 unrouted)
VCC  (via drill 0.3)
  Bottom 0.254: IC6.5 139.67,67.92 v139.7,67.94
  pour Top (isolate 0.305, rank 6): 0,100.33 160.02,100.33 160.02,0 0,0